# Altium project 海关全向控制器主控板V4.PrjPcb
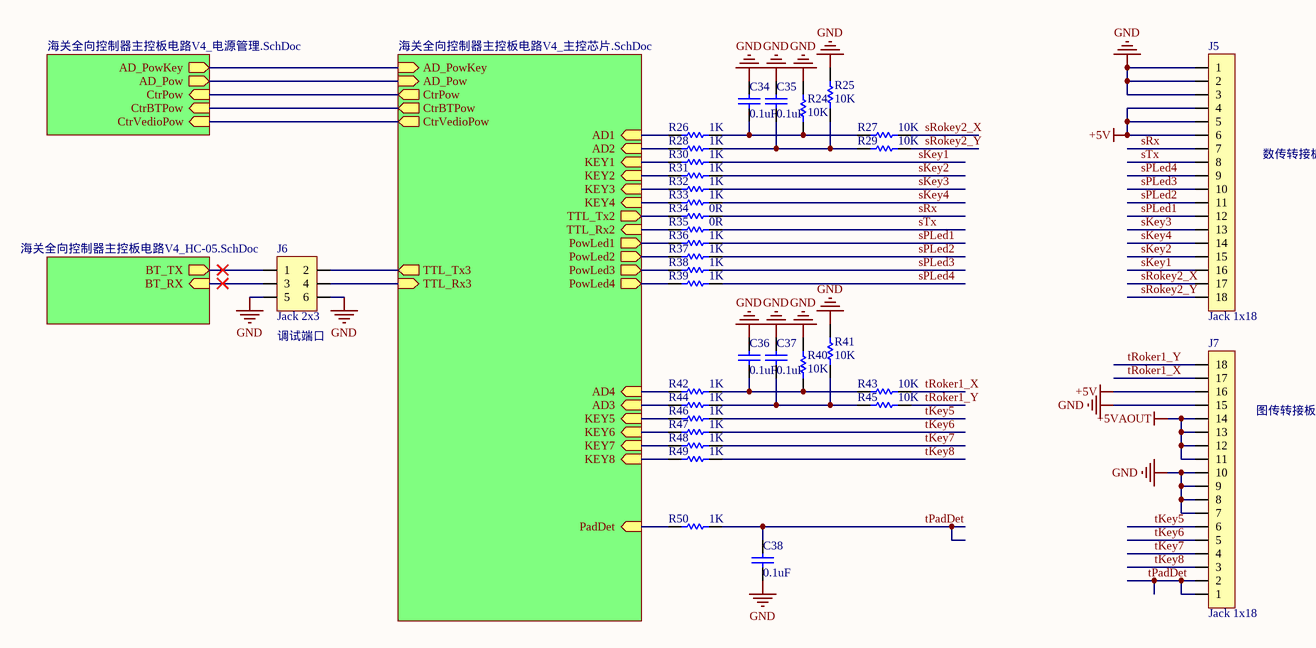
[diagram p0: 海关全向控制器主控板电路V4_系统管理.SchDoc]
4 sheets, 119 parts. Net scope: hierarchical (ports join the sheet entries above them; power ports are global).
Board file: 海关全向控制器主控板V4.PcbDoc
Sheets:
  海关全向控制器主控板电路V4_系统管理.SchDoc
    Designator = 海关全向控制器主控板电路V4_电源管理.SchDoc
    Designator = 海关全向控制器主控板电路V4_主控芯片.SchDoc
    Designator = 海关全向控制器主控板电路V4_HC-05.SchDoc

## Sheet 海关全向控制器主控板电路V4_系统管理.SchDoc
size A4

### Parts
C34  0.1uF  [C0805]
C35  0.1uF  [C0805]
C36  0.1uF  [C0805]
C37  0.1uF  [C0805]
C38  0.1uF  [C0805]
J5  Jack 1x18  [0.5S-6X-18PB]
J6  Jack 2x3  [Jk2*3-2.0]
J7  Jack 1x18  [0.5S-6X-18PB]
R24  10K  [R0805]
R25  10K  [R0805]
R26  1K  [R0805]
R27  10K  [R0805]
R28  1K  [R0805]
R29  10K  [R0805]
R30  1K  [R0805]
R31  1K  [R0805]
R32  1K  [R0805]
R33  1K  [R0805]
R34  0R  [R0805]
R35  0R  [R0805]
R36  1K  [R0805]
R37  1K  [R0805]
R38  1K  [R0805]
R39  1K  [R0805]
R40  10K  [R0805]
R41  10K  [R0805]
R42  1K  [R0805]
R43  10K  [R0805]
R44  1K  [R0805]
R45  10K  [R0805]
R46  1K  [R0805]
R47  1K  [R0805]
R48  1K  [R0805]
R49  1K  [R0805]
R50  1K  [R0805]

### Sub-sheets
Designator = 海关全向控制器主控板电路V4_电源管理.SchDoc: AD_PowKey (out), AD_Pow (out), CtrPow (in), CtrBTPow (in), CtrVedioPow (in)
Designator = 海关全向控制器主控板电路V4_主控芯片.SchDoc: AD_PowKey (in), AD_Pow (in), CtrPow (out), TTL_Rx2 (in), TTL_Tx2 (out), AD1 (in), AD2 (in), AD3 (in), AD4 (in), TTL_Tx3 (out), TTL_Rx3 (in), PadDet (in), CtrBTPow (out), KEY1 (in), KEY2 (in), KEY3 (in), KEY4 (in), PowLed1 (out), PowLed2 (out), PowLed3 (out), PowLed4 (out), KEY5 (in), KEY6 (in), KEY7 (in), KEY8 (in), CtrVedioPow (out)
Designator = 海关全向控制器主控板电路V4_HC-05.SchDoc: BT_RX (in), BT_TX (out)

### Nets
+5V: J5.4 J5.5 J5.6 J7.16
+5VAOUT: J7.11 J7.12 J7.13 J7.14
GND: C34.2 C35.2 C36.2 C37.2 C38.1 J5.1 J5.2 J5.3 J6.5 J6.6 J7.7 J7.8 J7.9 J7.10 J7.15 R24.1 R25.1 R40.1 R41.1
AD1: R26.2 ; sheet Designator/AD1
AD2: R28.2 ; sheet Designator/AD2
AD3: R44.2 ; sheet Designator/AD3
AD4: R42.2 ; sheet Designator/AD4
AD_Pow: sheet Designator/AD_Pow, sheet Designator/AD_Pow
AD_PowKey: sheet Designator/AD_PowKey, sheet Designator/AD_PowKey
BT_RX: J6.3 ; sheet Designator/BT_RX
BT_TX: J6.1 ; sheet Designator/BT_TX
CtrBTPow: sheet Designator/CtrBTPow, sheet Designator/CtrBTPow
CtrPow: sheet Designator/CtrPow, sheet Designator/CtrPow
CtrVedioPow: sheet Designator/CtrVedioPow, sheet Designator/CtrVedioPow
KEY1: R30.2 ; sheet Designator/KEY1
KEY2: R31.2 ; sheet Designator/KEY2
KEY3: R32.2 ; sheet Designator/KEY3
KEY4: R33.2 ; sheet Designator/KEY4
KEY5: R46.2 ; sheet Designator/KEY5
KEY6: R47.2 ; sheet Designator/KEY6
KEY7: R48.2 ; sheet Designator/KEY7
KEY8: R49.2 ; sheet Designator/KEY8
PadDet: R50.2 ; sheet Designator/PadDet
PowLed1: R36.2 ; sheet Designator/PowLed1
PowLed2: R37.2 ; sheet Designator/PowLed2
PowLed3: R38.2 ; sheet Designator/PowLed3
PowLed4: R39.2 ; sheet Designator/PowLed4
sKey1: J5.16 R30.1
sKey2: J5.15 R31.1
sKey3: J5.13 R32.1
sKey4: J5.14 R33.1
sPLed1: J5.12 R36.1
sPLed2: J5.11 R37.1
sPLed3: J5.10 R38.1
sPLed4: J5.9 R39.1
sRokey2_X: J5.17 R27.1
sRokey2_Y: J5.18 R29.1
sRx: J5.7 R34.1
sTx: J5.8 R35.1
tKey5: J7.6 R46.1
tKey6: J7.5 R47.1
tKey7: J7.4 R48.1
tKey8: J7.3 R49.1
tPadDet: C38.2 J7.1 J7.2 R50.1
tRoker1_X: J7.17 R43.1
tRoker1_Y: J7.18 R45.1
TTL_Rx2: R35.2 ; sheet Designator/TTL_Rx2
TTL_Rx3: J6.4 ; sheet Designator/TTL_Rx3
TTL_Tx2: R34.2 ; sheet Designator/TTL_Tx2
TTL_Tx3: J6.2 ; sheet Designator/TTL_Tx3
NetC34_1: C34.1 R24.2 R26.1 R27.2
NetC35_1: C35.1 R25.2 R28.1 R29.2
NetC36_1: C36.1 R40.2 R42.1 R43.2
NetC37_1: C37.1 R41.2 R44.1 R45.2

### Notes on the sheet
- 数传转接板
- (near J6) 调试端口
- (near J7) 图传转接板
- 文件名:
- 审核:
- 制图人:
- 孟浩
- 校对:
- 图号:
- 批准:
- 日期:

### Library data of the parts
C34-C38 = Cap: Capacitor; Published: 8-Jun-2000; Revision: July-2002: Re-released for DXP Platform.; Publisher: Altium Limited
J5 J7 = Jack 1x18: 插座
J6 = Jack 2x3: 双排座
R24-R50 = Res

## Sheet 海关全向控制器主控板电路V4_电源管理.SchDoc
size A4
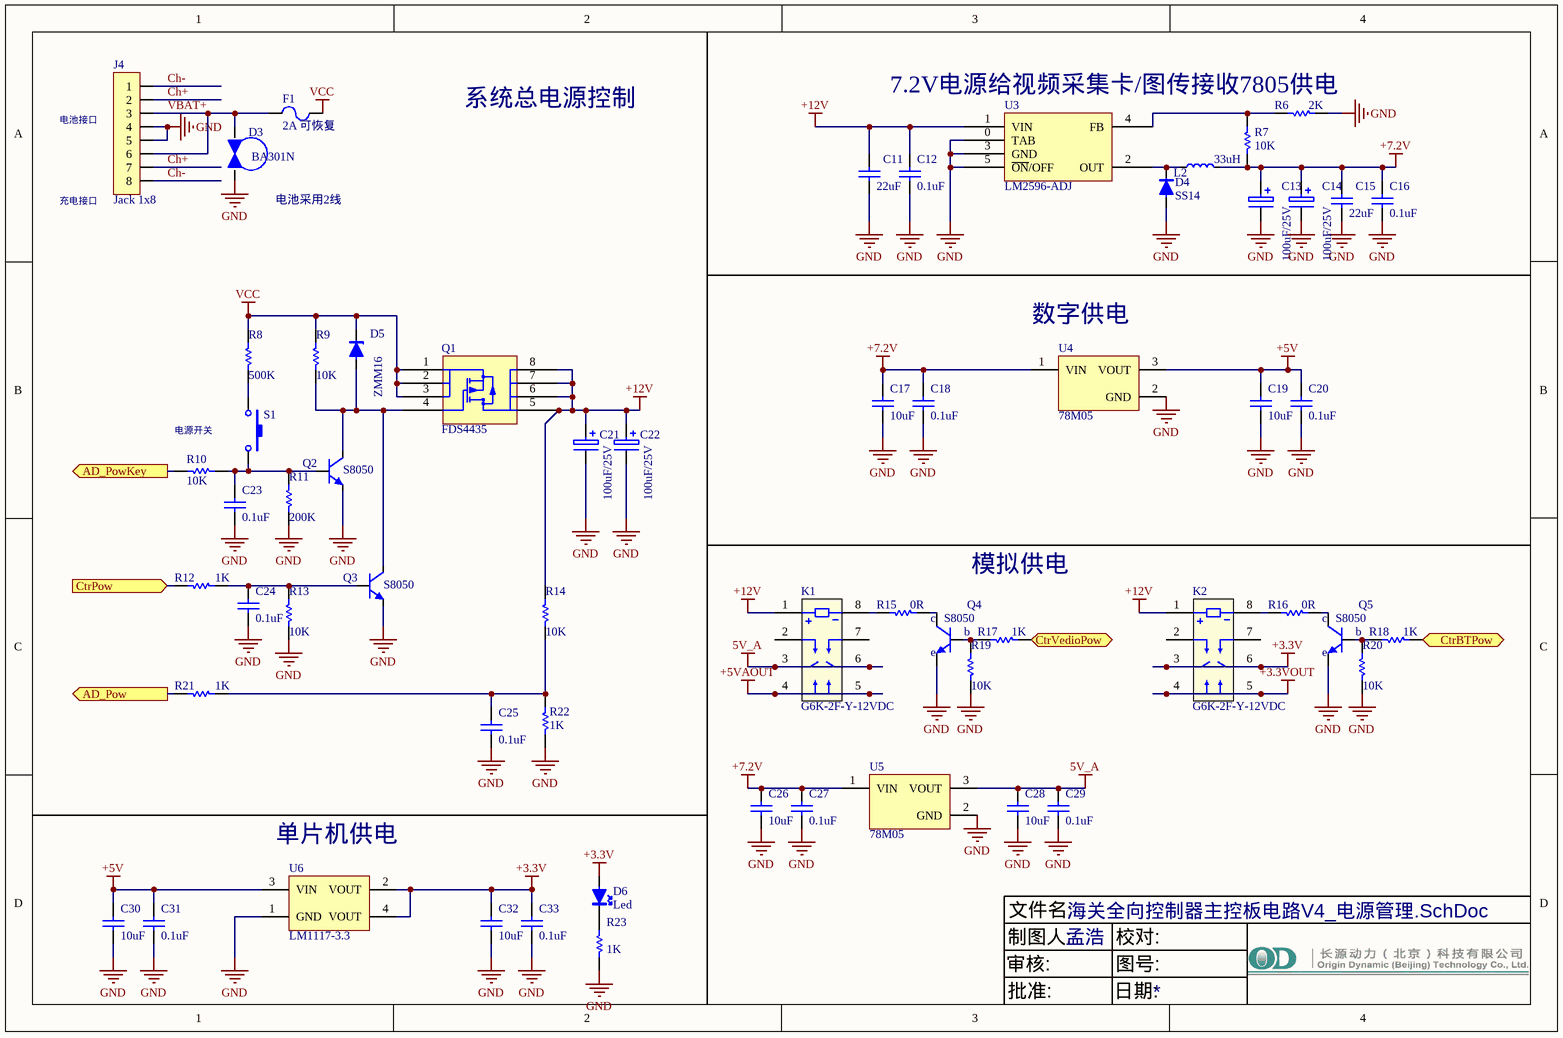
[diagram p1: 海关全向控制器主控板电路V4_电源管理.SchDoc]

### Parts
C11  22uF  [C1210]
C12  0.1uF  [C0805]
C13  100uF/25V  [C7343]
C14  100uF/25V  [C7343]
C15  22uF  [C1210]
C16  0.1uF  [C0805]
C17  10uF  [C0805]
C18  0.1uF  [C0805]
C19  10uF  [C0805]
C20  0.1uF  [C0805]
C21  100uF/25V  [C7343]
C22  100uF/25V  [C7343]
C23  0.1uF  [C0805]
C24  0.1uF  [C0805]
C25  0.1uF  [C0805]
C26  10uF  [C0805]
C27  0.1uF  [C0805]
C28  10uF  [C0805]
C29  0.1uF  [C0805]
C30  10uF  [C0805]
C31  0.1uF  [C0805]
C32  10uF  [C0805]
C33  0.1uF  [C0805]
D3  BA301N  [BA301N]
D4  SS14  [SMA]
D5  ZMM16  [SOD-80-S]
D6  Led  [LED0805]
F1  2A 可恢复  [F1812]
J4  Jack 1x8  [Pow-8P-M]
K1  G6K-2F-Y-12VDC  [G6K-2F-Y]
K2  G6K-2F-Y-12VDC  [G6K-2F-Y]
L2  33uH  [L6.6*7.1mm]
Q1  FDS4435  [SO8]
Q2  S8050  [SOT-23]
Q3  S8050  [SOT-23]
Q4  S8050  [SOT-23]
Q5  S8050  [SOT-23]
R6  2K  [R0805]
R7  10K  [R0805]
R8  500K  [R0805]
R9  10K  [R0805]
R10  10K  [R0805]
R11  200K  [R0805]
R12  1K  [R0805]
R13  10K  [R0805]
R14  10K  [R0805]
R15  0R  [R0805]
R16  0R  [R0805]
R17  1K  [R0805]
R18  1K  [R0805]
R19  10K  [R0805]
R20  10K  [R0805]
R21  1K  [R0805]
R22  1K  [R0805]
R23  1K  [R0805]
S1  SW-PB  [35363-0260]  (value not drawn)
U3  LM2596-ADJ  [TO-263-5]
U4  78M05  [TO-252]
U5  78M05  [TO-252]
U6  LM1117-3.3  [SOT-223]

### Ports
AD_Pow (out), AD_PowKey (out), CtrBTPow (in), CtrPow (in), CtrVedioPow (in)

### Nets
5V_A: C28.1 C29.1 K1.3 K1.6 U5.3(VOUT)
+3.3V: C32.1 C33.1 D6.1(A) K2.3 K2.6 U6.2(VOUT) U6.4(VOUT)
+3.3VOUT: K2.4 K2.5
+5V: C19.1 C20.1 C30.1 C31.1 U4.3(VOUT) U6.3(VIN)
+5VAOUT: K1.4 K1.5
+7.2V: C13.1 C14.1 C15.1 C16.2 C17.1 C18.1 C26.1 C27.1 L2.2 R7.2 U4.1(VIN) U5.1(VIN)
+12V: C11.1 C12.2 C21.1 C22.1 K1.1 K2.1 Q1.5 Q1.6 Q1.7 Q1.8 R14.1 U3.1(VIN)
GND: C11.2 C12.1 C13.2 C14.2 C15.2 C16.1 C17.2 C18.2 C19.2 C20.2 C21.2 C22.2 C23.2 C24.2 C25.2 C26.2 C27.2 C28.2 C29.2 C30.2 C31.2 C32.2 C33.2 D3.2 D4.1(A) J4.4 J4.5 Q2.2(E) Q3.2(E) Q4.2(e) Q5.2(e) R6.1 R11.2 R13.2 R19.2 R20.2 R22.1 R23.2 U3.0(TAB) U3.3(GND) U3.5(~{ON}/OFF) U4.2(GND) U5.2(GND) U6.1(GND)
VCC: D5.2(K) F1.2 Q1.1 Q1.2 Q1.3 R8.1 R9.1
AD_Pow: R21.1 ; port AD_Pow
AD_PowKey: R10.1 ; port AD_PowKey
Ch+: J4.2 J4.7
Ch-: J4.1 J4.8
CtrBTPow: R18.2 ; port CtrBTPow
CtrPow: R12.1 ; port CtrPow
CtrVedioPow: R17.2 ; port CtrVedioPow
VBAT+: D3.1 F1.1 J4.3 J4.6
NetC23_1: C23.1 Q2.1(B) R10.2 R11.1 S1.2
NetC24_1: C24.1 Q3.1(B) R12.2 R13.1
NetC25_1: C25.1 R14.2 R21.2 R22.2
NetD4_2: D4.2(K) L2.1 U3.2(OUT)
NetD5_1: D5.1(A) Q1.4 Q2.3(C) Q3.3(C) R9.2
NetD6_2: D6.2(K) R23.1
NetK1_8: K1.8 R15.1
NetK2_8: K2.8 R16.1
NetQ4_1: Q4.1(b) R17.1 R19.1
NetQ4_3: Q4.3(c) R15.2
NetQ5_1: Q5.1(b) R18.1 R20.1
NetQ5_3: Q5.3(c) R16.2
NetR6_2: R6.2 R7.1 U3.4(FB)
NetR8_2: R8.2 S1.1

Not connected (* = marked no-connect by the designer): K1 2 7; K2 2 7

### Notes on the sheet
- 系统总电源控制
- (near U3) 7.2V电源给视频采集卡/图传接收7805供电
- 电池接口
- 充电接口
- (near D3) 电池采用2线
- (near U4) 数字供电
- (near R10) 电源开关
- 模拟供电
- (near U6) 单片机供电
- 文件名:
- 审核:
- 制图人:
- 孟浩
- 校对:
- 图号:
- 批准:
- 日期:

### Library data of the parts
C11 C12 C15-C20 C23-C33 = CAP: Published: 8-Jun-2000; LatestRevisionDate: 17-Jul-2002; LatestRevisionNote: Re-released for DXP Platform.; PackageReference: RAD-0.3; Publisher: Altium Limited
C13 C14 = ELECTRO: Electrolytic Capacitor
C21 C22 = Cap Poll
D4 = Diode-Switch: Silicon Epitaxial Planar Diodes
D5 = DIODE-ZENER: Small Signal Zener Diodes
D6 = Led: light emitted diode
F1 = Fuse1
J4 = Jack 1x8: 插座
K1 K2 = G6K-2F-Y
L2 = INDUCTOR: Code_IEC: 1005; Published: 8-Jun-2000; LatestRevisionDate: 17-Jul-2002; LatestRevisionNote: Re-released for DXP Platform.; PackageReference: 0402-A; Publisher: Altium Limited; Code_JEITA: 0402
Q2 Q3 = NPN: NPN General Purpose Amplifier; Published: 8-Jun-2000; LatestRevisionDate: 15-Jan-2003; LatestRevisionNote: PCB Footprint 'BCY-W3/D4.7' replaced; DatasheetDocument: 1997; PackageDocument: Sep-1998; PackageReference: TO-92A; Publisher: Altium Limited; Code_JEDEC: TO-92A; ComponentLink1Description: Manufacturer Link; ComponentLink1URL: http://www.fairchildsemi.com/; ComponentLink2Description: Datasheet; ComponentLink2URL: http://www.fairchildsemi.com/ds/2N%2F2N3904.pdf
Q4 Q5 = S8050: NPN triode, 0.5A Max
R6-R23 = Res
S1 = SW-PB: Switch; Published: 24-Mar-1999; LatestRevisionDate: 17-Jul-2002; LatestRevisionNote: Re-released for DXP Platform.; PackageReference: SPST-2; Publisher: Altium Limited; PackageDescription: Switch; 2 Leads
U3 = LM25x6-5: LM2596-5;LM2576-5
U6 = LM1117: 800mA Linear Voltage Regulator

## Sheet 海关全向控制器主控板电路V4_主控芯片.SchDoc
size A4
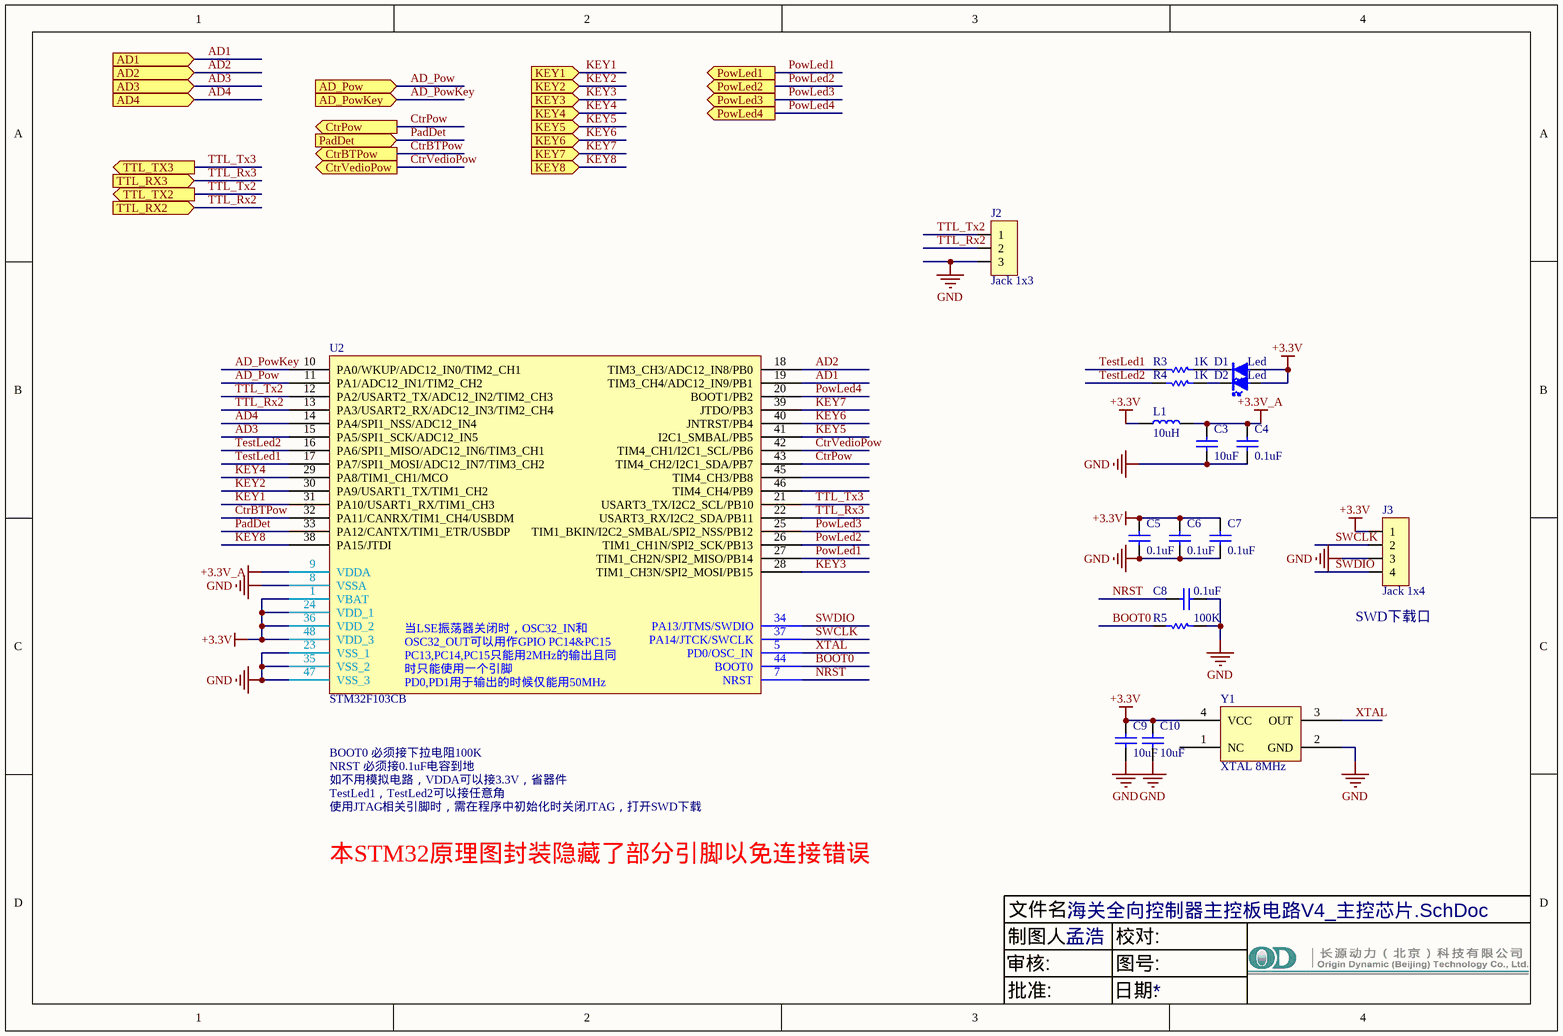
[diagram p2: 海关全向控制器主控板电路V4_主控芯片.SchDoc]

### Parts
C3  10uF  [C0805]
C4  0.1uF  [C0805]
C5  0.1uF  [C0805]
C6  0.1uF  [C0805]
C7  0.1uF  [C0805]
C8  0.1uF  [C0805]
C9  10uF  [C0805]
C10  10uF  [C0805]
D1  Led  [LED0805]
D2  Led  [LED0805]
J2  Jack 1x3  [Jk1*3-2.0]
J3  Jack 1x4  [Jk1*4-2.0]
L1  10uH  [L0805]
R3  1K  [R0805]
R4  1K  [R0805]
R5  100K  [R0805]
U2  STM32F103CB  [LQFP48]
Y1  XTAL 8MHz  [XTAL5032]

### Ports
AD1 (in), AD2 (in), AD3 (in), AD4 (in), AD_Pow (in), AD_PowKey (in), CtrBTPow (out), CtrPow (out), CtrVedioPow (out), KEY1 (in), KEY2 (in), KEY3 (in), KEY4 (in), KEY5 (in), KEY6 (in), KEY7 (in), KEY8 (in), PadDet (in), PowLed1 (out), PowLed2 (out), PowLed3 (out), PowLed4 (out), TTL_RX2 (in), TTL_RX3 (in), TTL_TX2 (out), TTL_TX3 (out)

### Nets
+3.3V: C5.1 C6.1 C7.1 C9.1 C10.1 D1.1(A) D2.1(A) J3.1 L1.1 U2.1(VBAT) U2.24(VDD_1) U2.36(VDD_2) U2.48(VDD_3) Y1.4(VCC)
+3.3V_A: C3.1 C4.1 L1.2 U2.9(VDDA)
GND: C3.2 C4.2 C5.2 C6.2 C7.2 C8.2 C9.2 C10.2 J2.3 J3.3 R5.2 U2.8(VSSA) U2.23(VSS_1) U2.35(VSS_2) U2.47(VSS_3) Y1.2(GND)
AD1: U2.19(TIM3_CH4/ADC12_IN9/PB1) ; port AD1
AD2: U2.18(TIM3_CH3/ADC12_IN8/PB0) ; port AD2
AD3: U2.15(PA5/SPI1_SCK/ADC12_IN5) ; port AD3
AD4: U2.14(PA4/SPI1_NSS/ADC12_IN4) ; port AD4
AD_Pow: U2.11(PA1/ADC12_IN1/TIM2_CH2) ; port AD_Pow
AD_PowKey: U2.10(PA0/WKUP/ADC12_IN0/TIM2_CH1) ; port AD_PowKey
BOOT0: R5.1 U2.44(BOOT0)
CtrBTPow: U2.32(PA11/CANRX/TIM1_CH4/USBDM) ; port CtrBTPow
CtrPow: U2.43(TIM4_CH2/I2C1_SDA/PB7) ; port CtrPow
CtrVedioPow: U2.42(TIM4_CH1/I2C1_SCL/PB6) ; port CtrVedioPow
KEY1: U2.31(PA10/USART1_RX/TIM1_CH3) ; port KEY1
KEY2: U2.30(PA9/USART1_TX/TIM1_CH2) ; port KEY2
KEY3: U2.28(TIM1_CH3N/SPI2_MOSI/PB15) ; port KEY3
KEY4: U2.29(PA8/TIM1_CH1/MCO) ; port KEY4
KEY5: U2.41(I2C1_SMBAL/PB5) ; port KEY5
KEY6: U2.40(JNTRST/PB4) ; port KEY6
KEY7: U2.39(JTDO/PB3) ; port KEY7
KEY8: U2.38(PA15/JTDI) ; port KEY8
NRST: C8.1 U2.7(NRST)
PadDet: U2.33(PA12/CANTX/TIM1_ETR/USBDP) ; port PadDet
PowLed1: U2.27(TIM1_CH2N/SPI2_MISO/PB14) ; port PowLed1
PowLed2: U2.26(TIM1_CH1N/SPI2_SCK/PB13) ; port PowLed2
PowLed3: U2.25(TIM1_BKIN/I2C2_SMBAL/SPI2_NSS/PB12) ; port PowLed3
PowLed4: U2.20(BOOT1/PB2) ; port PowLed4
SWCLK: J3.2 U2.37(PA14/JTCK/SWCLK)
SWDIO: J3.4 U2.34(PA13/JTMS/SWDIO)
TestLed1: R3.1 U2.17(PA7/SPI1_MOSI/ADC12_IN7/TIM3_CH2)
TestLed2: R4.1 U2.16(PA6/SPI1_MISO/ADC12_IN6/TIM3_CH1)
TTL_Rx2: J2.2 U2.13(PA3/USART2_RX/ADC12_IN3/TIM2_CH4) ; port TTL_RX2
TTL_Rx3: U2.22(USART3_RX/I2C2_SDA/PB11) ; port TTL_RX3
TTL_Tx2: J2.1 U2.12(PA2/USART2_TX/ADC12_IN2/TIM2_CH3) ; port TTL_TX2
TTL_Tx3: U2.21(USART3_TX/I2C2_SCL/PB10) ; port TTL_TX3
XTAL: U2.5(PD0/OSC_IN) Y1.3(OUT)
NetD1_2: D1.2(K) R3.2
NetD2_2: D2.2(K) R4.2

Not connected (* = marked no-connect by the designer): U2 2(PC13-TAMPER-RTC) 3(PC14-OSC32_IN) 4(PC15-OSC32_OUT) 6(PD1/OSC_OUT) 45(TIM4_CH3/PB8) 46(TIM4_CH4/PB9); Y1 1(NC)

### Notes on the sheet
- (near J3) SWD下载口
- BOOT0 必须接下拉电阻100K
- NRST 必须接0.1uF电容到地
- 如不用模拟电路，VDDA可以接3.3V，省器件
- TestLed1，TestLed2可以接任意角
- 使用JTAG相关引脚时，需在程序中初始化时关闭JTAG，打开SWD下载
- 本STM32原理图封装隐藏了部分引脚以免连接错误
- 文件名:
- 审核:
- 制图人:
- 孟浩
- 校对:
- 图号:
- 批准:
- 日期:
- (in symbol STM32F103Cx) OSC32_IN和OSC32_OUT可以用作通用IO PC14和PC15; PC13,PC14,PC15只能用于2MHz的输出模式且同时只能使用一个引脚; 当LSE振荡器关闭时，OSC32_IN和OSC32_OUT可以用作GPIO PC14&PC15 / PC13,PC14,PC15只能用2MHz的输出且同时只能使用一个引脚 / PD0,PD1用于输出的时候仅能用50MHz

### Library data of the parts
C3-C10 = CAP: Published: 8-Jun-2000; LatestRevisionDate: 17-Jul-2002; LatestRevisionNote: Re-released for DXP Platform.; PackageReference: RAD-0.3; Publisher: Altium Limited
D1 D2 = Led: light emitted diode
J2 = Jack 1x3: 插座
J3 = Jack 1x4: 插座
L1 = Inductor
R3-R5 = Res
U2 = STM32F103Cx
Y1 = XTAL

## Sheet 海关全向控制器主控板电路V4_HC-05.SchDoc
size A4
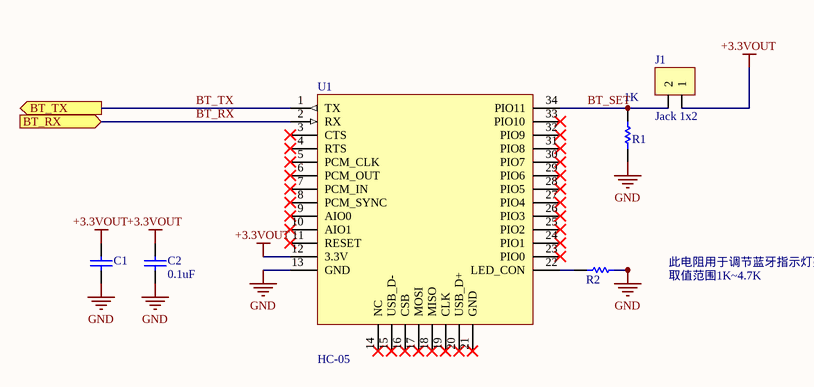
[diagram p3: 海关全向控制器主控板电路V4_HC-05.SchDoc]

### Parts
C1  10uF  [C0805]  (value not drawn)
C2  0.1uF  [C0805]
J1  Jack 1x2  [A6S-1101-PH]
R1  1K  [R0805]
R2  1K  [R0805]  (value not drawn)
U1  HC-05  [HC-05]

### Ports
BT_RX (in), BT_TX (out)

### Nets
+3.3VOUT: C1.1 C2.2 J1.1 U1.12(3.3V)
GND: C1.2 C2.1 R1.2 R2.1 U1.13(GND)
BT_RX: U1.2(RX) ; port BT_RX
BT_SET: J1.2 R1.1 U1.34(PIO11)
BT_TX: U1.1(TX) ; port BT_TX
NetR2_2: R2.2 U1.22(LED_CON)

Not connected (* = marked no-connect by the designer): U1 3(CTS)* 4(RTS)* 5(PCM_CLK)* 6(PCM_OUT)* 7(PCM_IN)* 8(PCM_SYNC)* 9(AIO0)* 10(AIO1)* 11(RESET)* 14(NC)* 15(USB_D-)* 16(CSB)* 17(MOSI)* 18(MISO)* 19(CLK)* 20(USB_D+)* 21(GND)* 23(PIO0)* 24(PIO1)* 25(PIO2)* 26(PIO3)* 27(PIO4)* 28(PIO5)* 29(PIO6)* 30(PIO7)* 31(PIO8)* 32(PIO9)* 33(PIO10)*

### Notes on the sheet
- 此电阻用于调节蓝牙指示灯亮度
- 取值范围1K~4.7K

### Library data of the parts
C1 = CAP: Published: 8-Jun-2000; LatestRevisionDate: 17-Jul-2002; LatestRevisionNote: Re-released for DXP Platform.; PackageReference: RAD-0.3; Publisher: Altium Limited
C2 = Cap Semi
J1 = Jack 1x2: 插座
R1 R2 = Res

## Nets that join several sheets
+3.3V: 海关全向控制器主控板电路V4_电源管理 (7 pins), 海关全向控制器主控板电路V4_主控芯片 (14 pins)
+3.3VOUT: 海关全向控制器主控板电路V4_电源管理 (K2.4 K2.5), 海关全向控制器主控板电路V4_HC-05 (C1.1 C2.2 J1.1 U1.12)
+5V: 海关全向控制器主控板电路V4_系统管理 (J5.4 J5.5 J5.6 J7.16), 海关全向控制器主控板电路V4_电源管理 (6 pins)
+5VAOUT: 海关全向控制器主控板电路V4_系统管理 (J7.11 J7.12 J7.13 J7.14), 海关全向控制器主控板电路V4_电源管理 (K1.4 K1.5)
GND: 海关全向控制器主控板电路V4_系统管理 (19 pins), 海关全向控制器主控板电路V4_电源管理 (44 pins), 海关全向控制器主控板电路V4_主控芯片 (16 pins), 海关全向控制器主控板电路V4_HC-05 (5 pins)
AD1: 海关全向控制器主控板电路V4_系统管理 (R26.2), 海关全向控制器主控板电路V4_主控芯片 (U2.19)
AD2: 海关全向控制器主控板电路V4_系统管理 (R28.2), 海关全向控制器主控板电路V4_主控芯片 (U2.18)
AD3: 海关全向控制器主控板电路V4_系统管理 (R44.2), 海关全向控制器主控板电路V4_主控芯片 (U2.15)
AD4: 海关全向控制器主控板电路V4_系统管理 (R42.2), 海关全向控制器主控板电路V4_主控芯片 (U2.14)
AD_Pow: 海关全向控制器主控板电路V4_电源管理 (R21.1), 海关全向控制器主控板电路V4_主控芯片 (U2.11)
AD_PowKey: 海关全向控制器主控板电路V4_电源管理 (R10.1), 海关全向控制器主控板电路V4_主控芯片 (U2.10)
BT_RX: 海关全向控制器主控板电路V4_系统管理 (J6.3), 海关全向控制器主控板电路V4_HC-05 (U1.2)
BT_TX: 海关全向控制器主控板电路V4_系统管理 (J6.1), 海关全向控制器主控板电路V4_HC-05 (U1.1)
CtrBTPow: 海关全向控制器主控板电路V4_电源管理 (R18.2), 海关全向控制器主控板电路V4_主控芯片 (U2.32)
CtrPow: 海关全向控制器主控板电路V4_电源管理 (R12.1), 海关全向控制器主控板电路V4_主控芯片 (U2.43)
CtrVedioPow: 海关全向控制器主控板电路V4_电源管理 (R17.2), 海关全向控制器主控板电路V4_主控芯片 (U2.42)
KEY1: 海关全向控制器主控板电路V4_系统管理 (R30.2), 海关全向控制器主控板电路V4_主控芯片 (U2.31)
KEY2: 海关全向控制器主控板电路V4_系统管理 (R31.2), 海关全向控制器主控板电路V4_主控芯片 (U2.30)
KEY3: 海关全向控制器主控板电路V4_系统管理 (R32.2), 海关全向控制器主控板电路V4_主控芯片 (U2.28)
KEY4: 海关全向控制器主控板电路V4_系统管理 (R33.2), 海关全向控制器主控板电路V4_主控芯片 (U2.29)
KEY5: 海关全向控制器主控板电路V4_系统管理 (R46.2), 海关全向控制器主控板电路V4_主控芯片 (U2.41)
KEY6: 海关全向控制器主控板电路V4_系统管理 (R47.2), 海关全向控制器主控板电路V4_主控芯片 (U2.40)
KEY7: 海关全向控制器主控板电路V4_系统管理 (R48.2), 海关全向控制器主控板电路V4_主控芯片 (U2.39)
KEY8: 海关全向控制器主控板电路V4_系统管理 (R49.2), 海关全向控制器主控板电路V4_主控芯片 (U2.38)
PadDet: 海关全向控制器主控板电路V4_系统管理 (R50.2), 海关全向控制器主控板电路V4_主控芯片 (U2.33)
PowLed1: 海关全向控制器主控板电路V4_系统管理 (R36.2), 海关全向控制器主控板电路V4_主控芯片 (U2.27)
PowLed2: 海关全向控制器主控板电路V4_系统管理 (R37.2), 海关全向控制器主控板电路V4_主控芯片 (U2.26)
PowLed3: 海关全向控制器主控板电路V4_系统管理 (R38.2), 海关全向控制器主控板电路V4_主控芯片 (U2.25)
PowLed4: 海关全向控制器主控板电路V4_系统管理 (R39.2), 海关全向控制器主控板电路V4_主控芯片 (U2.20)
TTL_Rx2: 海关全向控制器主控板电路V4_系统管理 (R35.2), 海关全向控制器主控板电路V4_主控芯片 (J2.2 U2.13)
TTL_Rx3: 海关全向控制器主控板电路V4_系统管理 (J6.4), 海关全向控制器主控板电路V4_主控芯片 (U2.22)
TTL_Tx2: 海关全向控制器主控板电路V4_系统管理 (R34.2), 海关全向控制器主控板电路V4_主控芯片 (J2.1 U2.12)
TTL_Tx3: 海关全向控制器主控板电路V4_系统管理 (J6.2), 海关全向控制器主控板电路V4_主控芯片 (U2.21)